# Altium schematic sheet POWER_Management.SchDoc: Metlino
size 420 x 297 mm; CheckedBy: P.Kulik,T.Przywozki,W.Ruclo; Author: G.Kasprowicz; CompanyName: WUT ISE; DrawnBy: G.Kasprowicz; Organization: WUT ISE; Address1: PW ISE; Address2: Nowowiejska 15/19 00-665 Warsaw; Address3: gkasprow@gmail.com; DocumentNumber: 20; Revision: 2; SheetNumber: 20; SheetTotal: 29; ModifiedBy: -; CheckedDate: -; Title2: Power Management Top; DivGrp: WUT ISE; Designer: G.Kasprowicz; ModifiedDate: -; ProjectName: Sensor Box
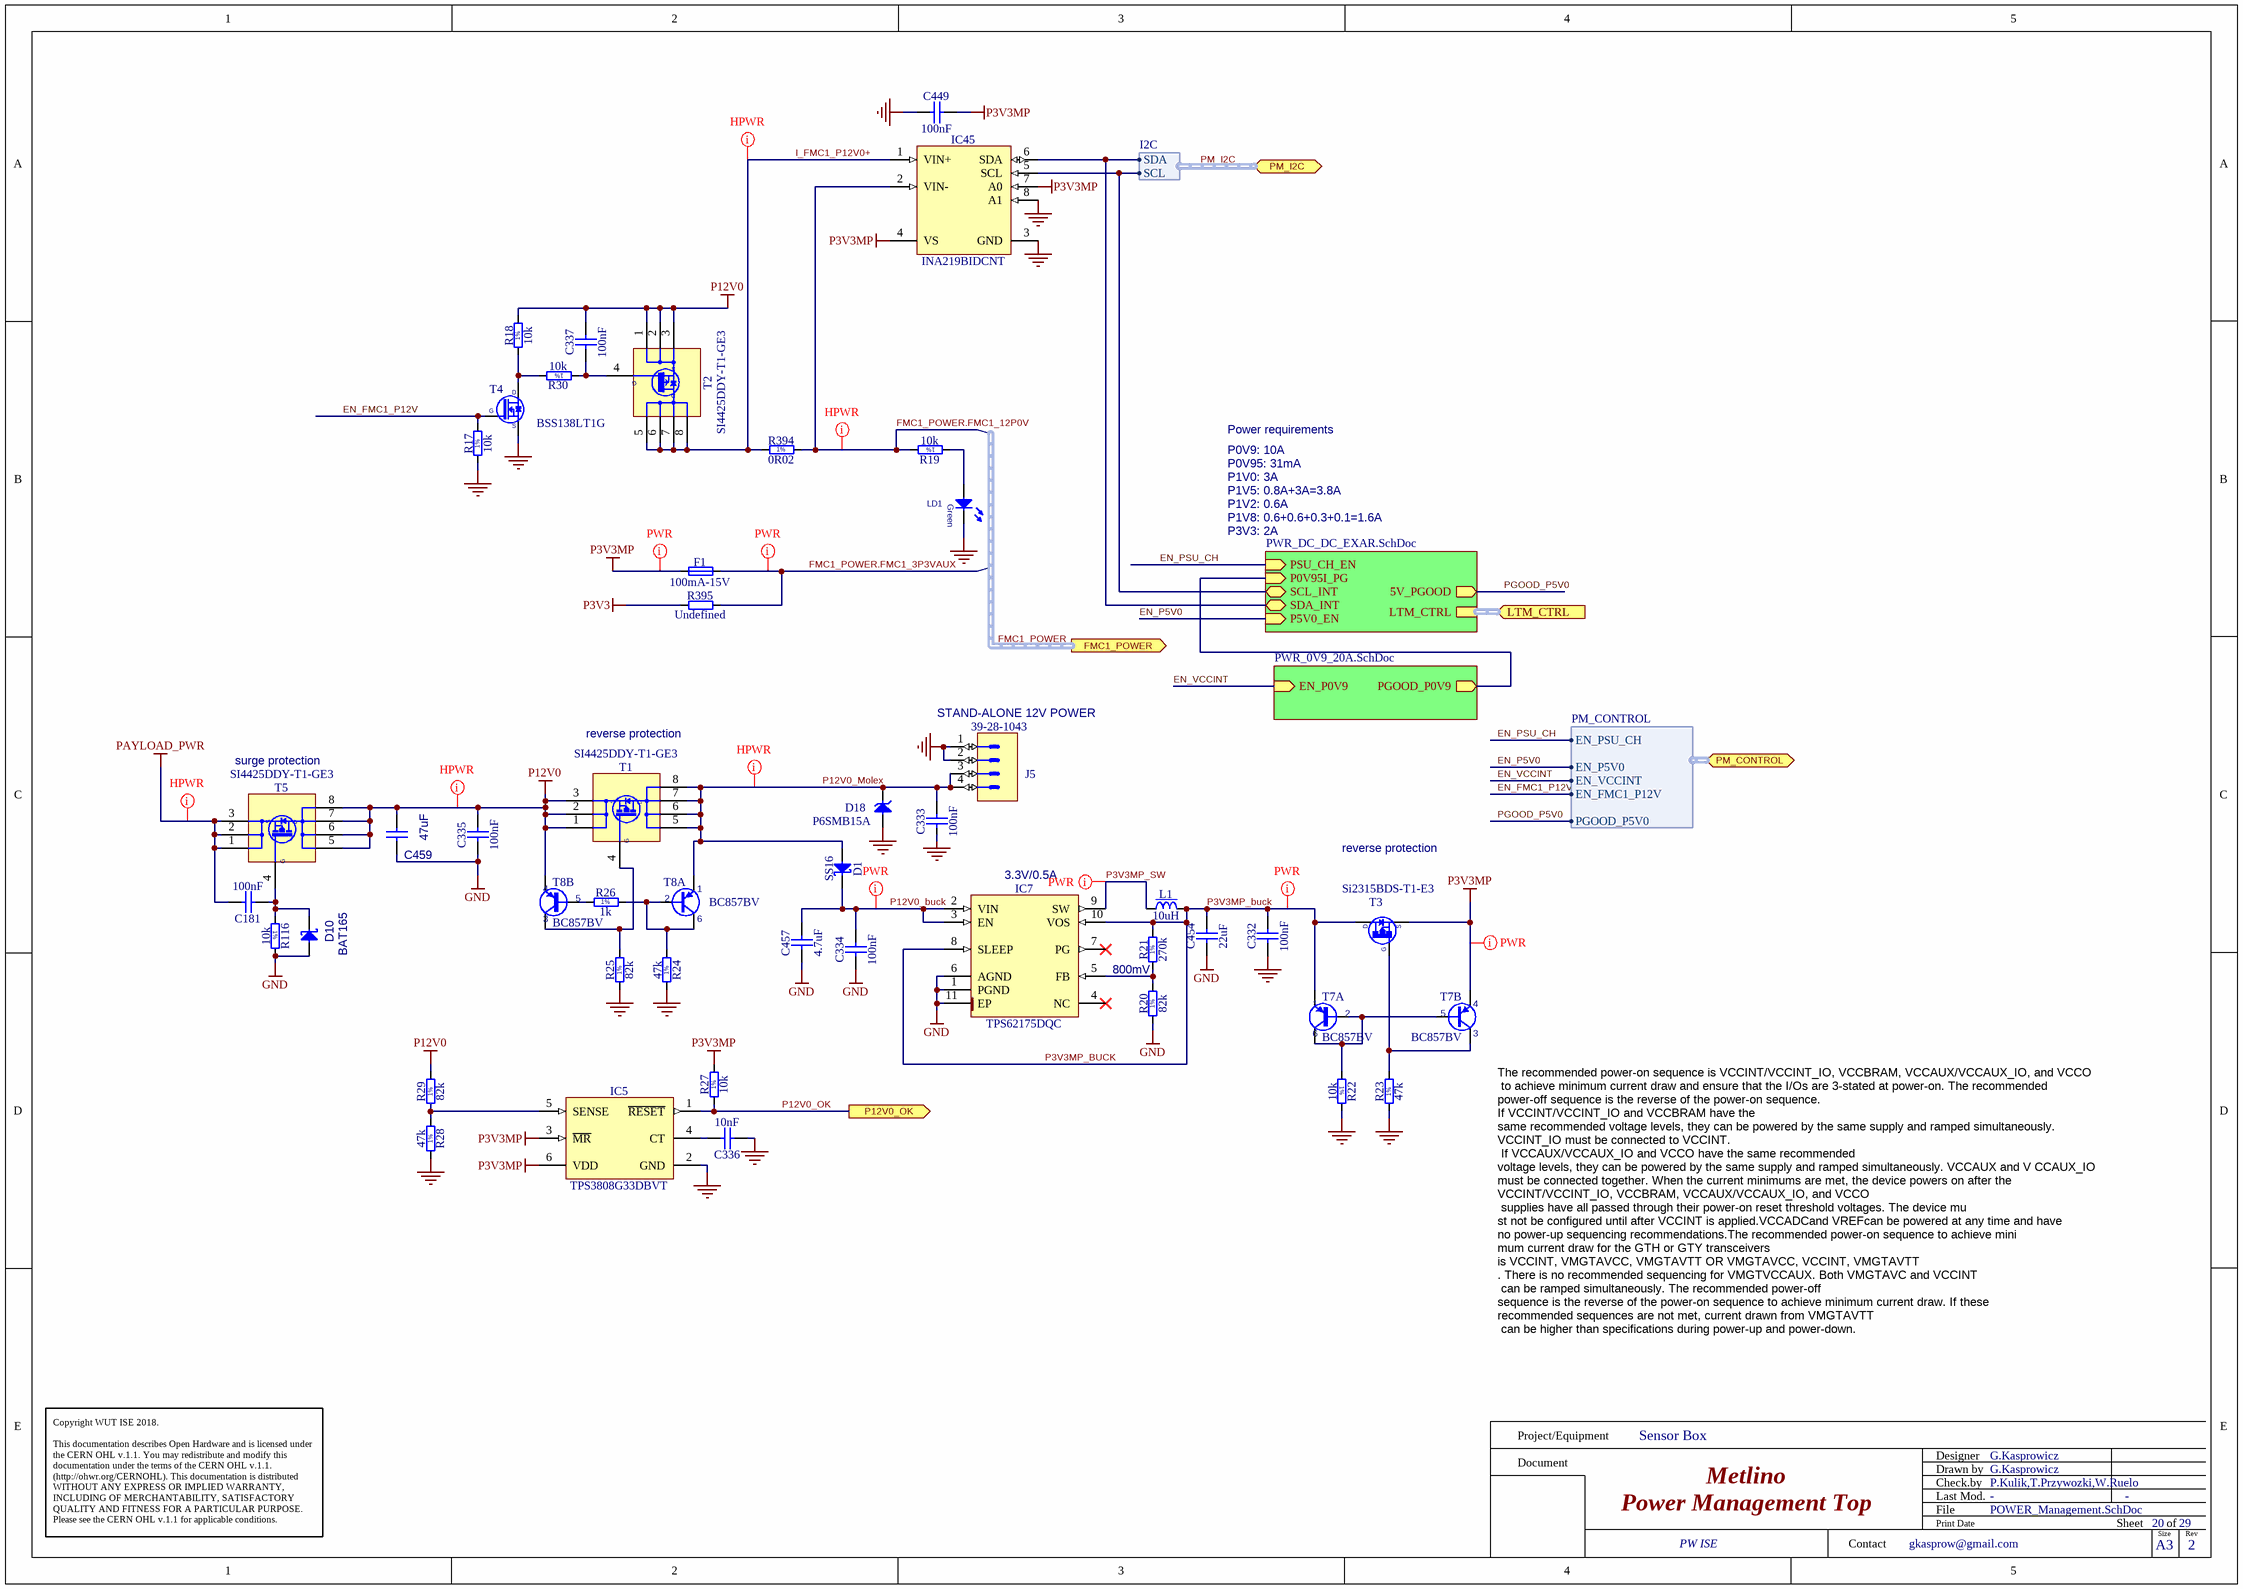
[diagram p0: POWER_Management.SchDoc]

## Parts
C181  100nF  [CAPC1005X55N]
C332  100nF  [CAPC1005X55N]
C333  100nF  [CAPC1005X55N]
C334  100nF  [CAPC1005X55N]
C335  100nF  [CAPC1005X55N]
C336  10nF  [CAPC1005X55N]
C337  100nF  [CAPC1005X55N]
C449  100nF  [CAPC1005X55N]
C454  22uF  [CAPC2012X135N]
C457  4.7uF  [CAPC1709X95N]
C459  47uF  [CAPC3216X180N]
D1  SS16  [DIOM5127X229N]
D10  BAT165  [SOD2512X110N]
D18  P6SMB15A  [DIOM5436X261N]
F1  100mA-15V  [FUSR_LITTELFUSE_0805L010]
IC5  TPS3808G33DBVT  [SOT95P280X145-6N]
IC7  TPS62175DQC  [SON50P200X300X80-11N-R94X250]
IC45  INA219BIDCNT  [SOT65P280X145-8N]
J5  Manufacturer Part Number: 39-28-1043  [MOLEX_39-28-1043]  (hidden comment: Mini-Fit Jr.™)
L1  10uH  [IND_MURATA-PS_8400]
LD1  LED_OSRAM_LG L29K-G2J1-24-Z  [LED_OSRAM_LGL29K]  (value not drawn)
R17  10k  [RESC1005X40N]
R18  10k  [RESC1005X40N]
R19  10k  [RESC1005X40N]
R20  82k  [RESC1005X40N]
R21  270k  [RESC1005X40N]
R22  10k  [RESC1005X40N]
R23  47k  [RESC1005X40N]
R24  47k  [RESC1005X40N]
R25  82k  [RESC1005X40N]
R26  1k  [RESC1005X40N]
R27  10k  [RESC1005X40N]
R28  47k  [RESC1005X40N]
R29  82k  [RESC1005X40N]
R30  10k  [RESC1005X40N]
R116  10k  [RESC1005X40N]
R394  0R02  [RESC_VISHAY_WSL2512_0R007-0R5]
R395  Undefined  [RESC2012X60N]
T1  SI4425DDY-T1-GE3  [SOIC127P600X175-8N]
T2  SI4425DDY-T1-GE3  [SOIC127P600X175-8N]
T3  Si2315BDS-T1-E3  [SOT95P237X112-3N]
T4  BSS138LT1G  [SOT95P240X110-3N]
T5  SI4425DDY-T1-GE3  [SOIC127P600X175-8N]
T7  BC857BV  [SOTFL50P160X60-6N]  (parts A,B of 2)
T8  BC857BV  [SOTFL50P160X60-6N]  (parts A,B of 2)

## Sub-sheets
PWR_0V9_20A = PWR_0V9_20A.SchDoc: PGOOD_P0V9 (out), EN_P0V9 (in)  | CmpIndex: 17; SymIndex: 784
PWR_DC_DC_EXAR = PWR_DC_DC_EXAR.SchDoc: PSU_CH_EN (in), P5V0_EN (in), 5V_PGOOD (out), SDA_INT (bidir), SCL_INT (bidir), LTM_CTRL (harness LTM_CTRL), P0V95I_PG (in)  | CmpIndex: 9; SymIndex: 296

## Ports
FMC1_POWER (out, harness FMC1_POWER), LTM_CTRL (in, harness LTM_CTRL), P12V0_OK (out), PM_CONTROL (bidir, harness PM_CONTROL), PM_I2C (bidir, harness I2C)

## Harnesses
I2C: SCL, SDA
PM_CONTROL: PGOOD_P5V0, EN_FMC1_P12V, EN_VCCINT, EN_P5V0, EN_PSU_CH

## Nets
GND: C332.1 C333.1 C334.1 C335.1 C336.1 C449.1 C454.1 C457.1 C459.1 D10.2(A) D18.2(A) IC5.2(GND) IC7.1(PGND) IC7.6(AGND) IC7.11(EP) IC45.3(GND) IC45.8(A1) J5.1 J5.2 LD1.1(C) R17.1 R20.1 R22.2 R23.1 R24.1 R25.1 R28.1 R116.2 T4.2(S)
P3V3: R395.1
P3V3MP: C449.2 F1.1 IC5.3(~{MR}) IC5.6(VDD) IC45.4(VS) IC45.7(A0) R27.2 T3.2(S) T7.4(E)
P12V0: C335.2 C337.2 C459.2 R18.2 R29.2 T1.1(S) T1.2(S) T1.3(S) T2.1(S) T2.2(S) T2.3(S) T5.5(D) T5.6(D) T5.7(D) T5.8(D) T8.4(E)
PAYLOAD_PWR: C181.2 T5.1(S) T5.2(S) T5.3(S)
EN_FMC1_P12V: R17.2 T4.1(G) ; port PM_CONTROL.EN_FMC1_P12V
EN_P5V0: sheet PWR_DC_DC_EXAR/P5V0_EN, port PM_CONTROL.EN_P5V0
EN_PSU_CH: sheet PWR_DC_DC_EXAR/PSU_CH_EN, port PM_CONTROL.EN_PSU_CH
EN_VCCINT: sheet PWR_0V9_20A/EN_P0V9, port PM_CONTROL.EN_VCCINT
FMC1_POWER.FMC1_3P3VAUX: F1.2 R395.2
FMC1_POWER.FMC1_12P0V: IC45.2(VIN-) R19.2 R394.2
I_FMC1_P12V0+: IC45.1(VIN+) R394.1 T2.5(D) T2.6(D) T2.7(D) T2.8(D)
P3V3MP_BUCK: C332.2 C454.2 IC7.8(SLEEP) IC7.10(VOS) L1.2 R21.2 T3.3(D) T7.1(E)
P3V3MP_SW: IC7.9(SW) L1.1
P12V0_buck: C334.2 C457.2 D1.1(C) IC7.2(VIN) IC7.3(EN)
P12V0_Molex: C333.2 D1.2(A) D18.1(C) J5.3 J5.4 T1.5(D) T1.6(D) T1.7(D) T1.8(D) T8.1(E)
P12V0_OK: IC5.1(~{RESET}) R27.1 ; port P12V0_OK
PGOOD_P5V0: sheet PWR_DC_DC_EXAR/5V_PGOOD, port PM_CONTROL.PGOOD_P5V0
PM_I2C.SCL: IC45.5(SCL) ; sheet PWR_DC_DC_EXAR/SCL_INT, port PM_I2C.SCL
PM_I2C.SDA: IC45.6(SDA) ; sheet PWR_DC_DC_EXAR/SDA_INT, port PM_I2C.SDA
NetC181_1: C181.1 D10.1(C) R116.1 T5.4(S)
NetC336_2: C336.2 IC5.4(CT)
NetC337_1: C337.1 R30.1 T2.4(S)
NetIC5_5: IC5.5(SENSE) R28.2 R29.1
NetIC7_5: IC7.5(FB) R20.2 R21.1
NetLD1_2: LD1.2(A) R19.1
NetR18_1: R18.1 R30.2 T4.3(D)
NetR22_1: R22.1 T7.2(B) T7.5(B) T7.6(C)
NetR23_2: R23.2 T3.1(G) T7.3(C)
NetR24_2: R24.2 R26.2 T8.2(B) T8.6(C)
NetR25_2: R25.2 T1.4(S) T8.3(C)
NetR26_1: R26.1 T8.5(B)
(unnamed): sheet PWR_0V9_20A/PGOOD_P0V9, sheet PWR_DC_DC_EXAR/P0V95I_PG

Not connected (* = marked no-connect by the designer): IC7 4(NC)* 7(PG)*

## Buses and harness runs
harness FMC1_POWER = port FMC1_POWER
harness PM_I2C = port PM_I2C
harness port LTM_CTRL = sheet PWR_DC_DC_EXAR/LTM_CTRL

## Layout directives
net class PWR: FMC1_POWER.FMC1_3P3VAUX, P3V3MP, P3V3MP_BUCK, P3V3MP_SW, P12V0_buck
net class HPWR: FMC1_POWER.FMC1_12P0V, I_FMC1_P12V0+, P12V0, P12V0_Molex, PAYLOAD_PWR

## Notes on the sheet
- P0V9: 10A
- Power requirements
- P0V95: 31mA
- P1V0: 3A
- P1V8: 0.6+0.6+0.3+0.1=1.6A
- P1V2: 0.6A
- P1V5: 0.8A+3A=3.8A
- P3V3: 2A
- (near T1) reverse protection
- (near J5) STAND-ALONE 12V POWER
- (near T5) surge protection
- reverse protection
- (near IC7) 3.3V/0.5A
- 800mV
- (near T7) The recommended power-on sequence is VCCINT/VCCINT_IO, VCCBRAM, VCCAUX/VCCAUX_IO, and VCCO
  to achieve minimum current draw and ensure that the I/Os are 3-stated at power-on. The recommended
  power-off sequence is the reverse of the power-on sequence.
  If VCCINT/VCCINT_IO and VCCBRAM have the
  same recommended voltage levels, they can be powered by the same supply and ramped simultaneously.
  VCCINT_IO must be connected to VCCINT.
  If VCCAUX/VCCAUX_IO and VCCO have the same recommended
  voltage levels, they can be powered by the same supply and ramped simultaneously. VCCAUX and V CCAUX_IO
  must be connected together. When the current minimums are met, the device powers on after the
  VCCINT/VCCINT_IO, VCCBRAM, VCCAUX/VCCAUX_IO, and VCCO
  supplies have all passed through their power-on reset threshold voltages. The device mu
  st not be configured until after VCCINT is applied.VCCADCand VREFcan be powered at any time and have
  no power-up sequencing recommendations.The recommended power-on sequence to achieve mini
  mum current draw for the GTH or GTY transceivers
  is VCCINT, VMGTAVCC, VMGTAVTT OR VMGTAVCC, VCCINT, VMGTAVTT
  . There is no recommended sequencing for VMGTVCCAUX. Both VMGTAVC and VCCINT
  can be ramped simultaneously. The recommended power-off
  sequence is the reverse of the power-on sequence to achieve minimum current draw. If these
  recommended sequences are not met, current drawn from VMGTAVTT
  can be higher than specifications during power-up and power-down.
- Project/Equipment
- Document
- Designer
- Drawn by
- Check.by
- Copyright WUT ISE 2018.
  This documentation describes Open Hardware and is licensed under the CERN OHL v.1.1. You may redistribute and modify this documentation under the terms of the CERN OHL v.1.1. (http://ohwr.org/CERNOHL). This documentation is distributed WITHOUT ANY EXPRESS OR IMPLIED WARRANTY, INCLUDING OF MERCHANTABILITY, SATISFACTORY QUALITY AND FITNESS FOR A PARTICULAR PURPOSE. Please see the CERN OHL v.1.1 for applicable conditions.
- Contact
- File
- Last Mod.
- Print Date
- Sheet
- Size
- A3
- of
- Rev
- (in symbol R0402_1K_1%_0.0625W_100PPM) 1%
- (in symbol R0402_10K_1%_0.0625W_100PPM) 1%
- (in symbol R0402_47K_1%_0.0625W_100PPM) 1%
- (in symbol R0402_82K_1%_0.0625W_100PPM) 1%
- (in symbol R0402_270K_1%_0.0625W_100PPM) 1%
- (in symbol R2512_0R02_1%_1W_75PPM_VISHAY_WSL) 1%
- (in symbol SI4425DDY-T1-GE3) G

## Library data of the parts
C181 C332-C335 C337 C449 = CC0402_100NF_16V_10%_X5R: Non-polarised capacitor; Manufacturer: GENERIC; Part Description: SMD Multilayer Chip Ceramic Capacitor; Manufacturer1 Part Number: GRM155R61C104KA88D; Tolerance: ±10%; Voltage: 16V; TC: X5R; Manufacturer Part Number: CC0402_100NF_16V_10%_X5R; Part Number: CC0402_100NF_16V_10%_X5R; Value: 100nF; Component Kind: Standard; Component Type: Standard; Pin Count: 2; Status: None; Case: 0402; Mounted: Yes; Socket: No; SMD: Yes; Sense: No; Manufacturer1 Example: MURATA; Manufacturer1 ComponentHeight: 0.55mm; HelpURL: \\cern.ch\dfs\Applications\Altium\Datasheets\CC0402_X5R_MURATA_GRM.pdf; Author: CERN DEM JLC; CreateDate: 10.12.2013; LatestRevisionDate: 10.12.2013
C336 = CC0402_10NF_16V_10%_X7R: Non-polarised capacitor; Manufacturer: GENERIC; Part Description: SMD Multilayer Chip Ceramic Capacitor; Manufacturer1 Part Number: 223878715636; Tolerance: ±10%; Voltage: 16V; TC: X7R; Manufacturer Part Number: CC0402_10NF_16V_10%_X7R; Part Number: CC0402_10NF_16V_10%_X7R; Value: 10nF; Component Kind: Standard; Component Type: Standard; Pin Count: 2; Status: Not Recommended; Case: 0402; Mounted: Yes; Socket: No; SMD: Yes; Sense: No; Manufacturer1 Example: PHYCOMP; Manufacturer1 ComponentHeight: 0.55mm; HelpURL: \\cern.ch\dfs\Applications\Altium\Datasheets\CC0402_X7R_PHYCOMP.pdf; Author: CERN DEM JLC; CreateDate: 03.12.2007; LatestRevisionDate: 03.12.2007
C454 = CC0805_22UF_16V_10%_X5R: Non-polarised capacitor; Manufacturer: GENERIC; Part Description: SMD Multilayer Chip Ceramic Capacitor; Manufacturer1 Part Number: C2012X5R1C226KT; Tolerance: ±10%; Voltage: 16V; TC: X5R; Manufacturer Part Number: CC0805_22UF_16V_10%_X5R; Part Number: CC0805_22UF_16V_10%_X5R; Value: 22uF; Component Kind: Standard; Component Type: Standard; Pin Count: 2; Status: Preferred; Case: 0805; Mounted: Yes; Socket: No; SMD: Yes; Sense: No; Manufacturer1 Example: TDK; Manufacturer1 ComponentHeight: 1.35mm; HelpURL: \\cern.ch\dfs\Applications\Altium\Datasheets\CC0805_X5R_TDK_C.pdf; Author: CERN DEM JLC; CreateDate: 25.10.2012; LatestRevisionDate: 25.10.2012
C457 = CC0603_4.7UF_16V_10%_X5R: Non-polarised capacitor; Manufacturer: GENERIC; Part Description: SMD Multilayer Chip Ceramic Capacitor; Manufacturer1 Part Number: EMK107ABJ475KA-T; Tolerance: ±10%; Voltage: 16V; TC: X5R; Manufacturer Part Number: CC0603_4.7UF_16V_10%_X5R; Part Number: CC0603_4.7UF_16V_10%_X5R; Value: 4.7uF; Component Kind: Standard; Component Type: Standard; Pin Count: 2; Status: None; Case: 0603; Mounted: Yes; Socket: No; SMD: Yes; Sense: No; Manufacturer1 Example: TAIYO YUDEN; Manufacturer1 ComponentHeight: 0.95mm; HelpURL: \\cern.ch\dfs\Applications\Altium\Datasheets\CC0603_X7R_TAIYO-YUDEN_HIGH-VALUE.pdf; Author: CERN DEM JLC; CreateDate: 16.12.2013; LatestRevisionDate: 16.09.2014
C459 = CAPC3216X180N: $$NotCommonProperty_General Part Number: CC1206_47UF_25V_20%_X5R; Manufacturer Part Number: C3216X5R1E476M160AC; Manufacturer: TDK; Part Description: SMD Multilayer Chip Ceramic Capacitor; Part Name: Capacitor - non polarized CAPC3216X180N; $$Internal_Resolution: 00001mm; $$NotCommonProperty_Case: 1206; $$NotCommonProperty_Pin Count: 2; $$NotCommonProperty_SMD: Yes; $$NotCommonProperty_Status: None; $$NotCommonProperty_TC: X5R; $$NotCommonProperty_Voltage: 25V; CmpIndex: 100; DXDB_LIBNAME: Capacitors SMD; Ref Designator: C459; SymIndex: 331; Tolerance: ±20%; $$NotCommonProperty_ComponentHeight: 1.8mm; Cell Name: CAPC3216X180N; Part Number: Capacitor - non polarized CAPC3216X180N; Value: 47uF; Orientation: 1 = 1
D1 = SS16: Schottky Diode; Manufacturer: VISHAY GENERAL SEMICONDUCTOR; Part Description: Surface Mount Schottky Barrier Rectifier; Voltage: 60V; Power: 1A; PressFit: No; Bonding: No; Manufacturer Part Number: SS16; PackageDescription: DO-214-AC Molded Diode, Body 5.1x2.7mm, IPC Medium Density; Part Number: SS16; Component Kind: Standard; Component Type: Standard; Device: SS16; Pin Count: 2; Case: DO-214AC; Mounted: Yes; Socket: No; SMD: Yes; Sense: No; ComponentHeight: 2.29mm; HelpURL: \\cern.ch\dfs\Applications\Altium\Datasheets\SS16.pdf; Author: CERN DEM JLC; CreateDate: 15.07.2008; LatestRevisionDate: 23.08.2010
D10 = SOD2512X110N: Manufacturer: INFINEON; Part Description: Medium Power AF Schottky Diode; $$Internal_Resolution: 00001mm; $$NotCommonProperty_Bonding: No; $$NotCommonProperty_Case: SOD323; $$NotCommonProperty_Library Ref: Diode Schottky; $$NotCommonProperty_Mounted: Yes; $$NotCommonProperty_Pin Count: 2; $$NotCommonProperty_Power: 750mA; $$NotCommonProperty_PressFit: No; $$NotCommonProperty_Voltage: 40V; CmpIndex: 25; DXDB_LIBNAME: Diodes; SymIndex: 381; $$NotCommonProperty_ComponentHeight: 1.1mm; $$NotCommonProperty_Device: BAT165; $$NotCommonProperty_Footprint Ref: SOD2512X110N; $$NotCommonProperty_Sense: No; $$NotCommonProperty_SMD: Yes; $$NotCommonProperty_Socket: No; Cell Name: SOD2512X110N; Manufacturer Part Number: BAT165; PackageDescription: Small Outline Diode Flat Lead (SOD-323), 1.70mm W X 1.25mm L X 1.10mm H body,  IPC Medium Density; Part Name: BAT165; Part Number: BAT165; Orientation: 1 = 1
D18 = P6SMB15A: Transient Voltage Suppressor Diode (Uni-Directional); Manufacturer: LITTELFUSE; Part Description: Uni-directional Transient Voltage Suppressor (TVS) Diode; Voltage: 15V; Power: 600W; PressFit: No; Bonding: No; Manufacturer Part Number: P6SMB15A; PackageDescription: DO-214-AA/SMB Diode, Molded Body; 5.40mm L X 3.62mm W X 2.61mm H, IPC Medium Density; Part Number: P6SMB15A; Component Kind: Standard; Component Type: Standard; Device: P6SMB15A; Pin Count: 2; Case: SMB; Mounted: Yes; Socket: No; SMD: Yes; Sense: No; ComponentHeight: 2.61mm; HelpURL: \\cern.ch\dfs\Applications\Altium\Datasheets\P6SMB15A.pdf; Author: CERN DEM JLC; CreateDate: 12.07.2017; LatestRevisionDate: 12.07.2017
F1 = FUSR_LITTELFUSE_0805L010YR: Fuse; Part Description: POLYFUSE® Surface Mount Resettable PTC; PressFit: No; Manufacturer Part Number: 0805L010YR; Manufacturer: LITTELFUSE; PackageDescription: Surface Mount POLY-FUSE® Resettable PTC, 0805L Series; Part Number: FUSR_LITTELFUSE_0805L010YR; Value: 100mA-15V; Component Kind: Standard; Component Type: Standard; Pin Count: 2; Family: Fuses Resettable; Mounted: Yes; Socket: No; SMD: Yes; Sense: No; ComponentHeight: 1mm; HelpURL: \\cern.ch\dfs\Applications\Altium\Datasheets\FUSR_LITTELFUSE_0805L010YR.pdf; Author: CERN DEM JLC; CreateDate: 11.09.2012; LatestRevisionDate: 11.09.2012
IC5 = TPS3808G33DBVT: Low Quiescent Current, Programmable-Delay Supervisory Circuit; Manufacturer: TEXAS INSTRUMENTS; Part Description: 3.3V, Low Quiescent Current, Programmable-Delay Supervisory Circuit; PressFit: No; Bonding: No; Manufacturer Part Number: TPS3808G33DBVT; PackageDescription: SOT23, 6-Leads, Body 1.6x3.0mm, Pitch 0.95mm, IPC Medium Density; Part Number: TPS3808G33DBVT; Component Kind: Standard; Component Type: Standard; Device: TPS3808G33DBVT; Pin Count: 6; Case: SOT23-6; Mounted: Yes; Socket: No; SMD: Yes; Sense: No; ComponentHeight: 1.45mm; Author: CERN DEM JLC; HelpURL: \\cern.ch\dfs\Applications\Altium\Datasheets\TPS3808G33DBVT.pdf; CreateDate: 05.11.2013; LatestRevisionDate: 05.11.2013
IC7 = TPS62175DQC: 4.75-28VDC to 1-6VDC, 500mA Step-Down Converter With Sleep Mode; Manufacturer: TEXAS INSTRUMENTS; PressFit: No; Bonding: No; Manufacturer Part Number: TPS62175DQC; PackageDescription: SON, 10-Leads, Body 2x3mm, Pitch 0.5mm, Thermal Pad 0.94x2.5mm, IPC Medium Density; Part Description: 4.75-28VDC to 1-6VDC, 500mA Step-Down Converter With Sleep Mode; Part Number: TPS62175DQC; Component Kind: Standard; Component Type: Standard; Device: TPS62175DQC; Pin Count: 11; Case: SON10; Mounted: Yes; Socket: No; SMD: Yes; Sense: No; ComponentHeight: 0.8mm; HelpURL: \\cern.ch\dfs\Applications\Altium\Datasheets\TPS62175DQC.pdf; Author: CERN DEM JMW; CreateDate: 11.08.2015; LatestRevisionDate: 11.08.2015
IC45 = INA219BIDCNT: Zero-Drift, Bi-Directional CURRENT/POWER MONITOR with I2C™ Interface; Manufacturer: TEXAS INSTRUMENTS; PressFit: No; Bonding: No; Manufacturer Part Number: INA219BIDCNT; PackageDescription: SOT, 0.65mm pitch; 8 pin, 1.625mm W X 2.90mm L X 1.45mm H body, IPC Medium Density; Part Description: Zero-Drift, Bi-Directional CURRENT/POWER MONITOR with I2C™ Interface; Part Number: INA219BIDCNT; Component Kind: Standard; Component Type: Standard; Device: INA219BIDCNT; Pin Count: 8; Case: SOT23-8; Mounted: Yes; Socket: No; SMD: Yes; Sense: No; ComponentHeight: 1.45mm; Author: CERN DEM JLC; HelpURL: \\cern.ch\dfs\Applications\Altium\Datasheets\INA219BIDCNT.pdf; CreateDate: 24.09.2013; LatestRevisionDate: 24.09.2013
J5 = MOLEX_39-28-1043: Connector 4 Male; Manufacturer: MOLEX; Part Description: 4.20mm (.165") Pitch Mini-Fit Jr.™ Header, Dual Row, Vertical, without Snap-in Plastic Peg PCB Lock, 4 Circuits; PressFit: No; Part Number: MOLEX_39-28-1043; Component Kind: Standard; Component Type: Standard; Pin Count: 4; Family: Mini-Fit Jr.™; Mounted: Yes; Socket: No; SMD: No; Sense: No; Status: None; ComponentHeight: 13.1mm; HelpURL: \\cern.ch\dfs\Applications\Altium\Datasheets\MOLEX_39-28-1043.pdf; Author: CERN DEM JLC; CreateDate: 12.03.2009; LatestRevisionDate: 06.03.2012
L1 = IND_10UH_10%_MURATA-PS_8400: Inductor With Core; Manufacturer Part Number: 84103C; Manufacturer: MURATA POWER SOLUTIONS; Part Description: Miniature Surface Mount Power Inductor (8400 Series); Tolerance: ±10%; Power: 950mA; Resistance: 0.24R; Part Number: IND_10UH_10%_MURATA-PS_8400; Value: 10uH; Component Kind: Standard; Component Type: Standard; Pin Count: 2; Status: None; Mounted: Yes; Socket: No; SMD: Yes; Sense: No; ComponentHeight: 2.9mm; HelpURL: \\cern.ch\dfs\Applications\Altium\Datasheets\IND_MURATA-PS_8400.pdf; Author: CERN DEM JLC; CreateDate: 02.07.2012; LatestRevisionDate: 02.07.2012
LD1 = LED_OSRAM_LGL29K: Manufacturer: OSRAM; Part Description: Surface Mount Green LED (0603 Case); $$Internal_Resolution: 00001mm; $$NotCommonProperty_Author: CERN DEM JLC; $$NotCommonProperty_Bonding: No; $$NotCommonProperty_Case: 0603; $$NotCommonProperty_Color: Green; $$NotCommonProperty_Component Kind: Standard; $$NotCommonProperty_HelpURL: \\cern.ch\dfs\Applications\Altium\Datasheets\LED_OSRAM_LGL29K.pdf; $$NotCommonProperty_Mounted: Yes; $$NotCommonProperty_Pin Count: 2; $$NotCommonProperty_PressFit: No; $$NotCommonProperty_Table: LEDs & Displays; CmpIndex: 61; DXDB_LIBNAME: LED_Displays; Ref Designator: LD1; SymIndex: 383; $$NotCommonProperty_Component Type: Standard; $$NotCommonProperty_ComponentHeight: 0.67mm; $$NotCommonProperty_CreateDate: 2012-04-24; $$NotCommonProperty_Footprint Ref: LED_OSRAM_LGL29K; $$NotCommonProperty_LatestRevisionDate: 2012-04-24; $$NotCommonProperty_Sense: No; $$NotCommonProperty_SMD: Yes; $$NotCommonProperty_Socket: No; Cell Name: LED_OSRAM_LGL29K; Manufacturer Part Number: LG L29K-G2J1-24-Z; PackageDescription: Green Chip LED, 2-Leads, Body 1.7x0.8mm, IPC Medium Density; Part Name: LED_OSRAM_LG L29K-G2J1-24-Z; Part Number: LED_OSRAM_LG L29K-G2J1-24-Z; Orientation: 3 = 3
R17-R19 R22 R27 R30 R116 = R0402_10K_1%_0.0625W_100PPM: Resistor - 1%; Manufacturer: GENERIC; Part Description: General Purpose Thick Film Chip Resistor; Manufacturer1 Part Number: 232270671003L; TC: ±100ppm/°C; PressFit: No; Manufacturer Part Number: R0402_10K_1%_0.0625W_100PPM; Part Number: R0402_10K_1%_0.0625W_100PPM; Tolerance: ±1%; Value: 10k; Component Kind: Standard; Component Type: Standard; Pin Count: 2; Status: Not Recommended; Power: 0.0625W; Case: 0402; Mounted: Yes; Sense: No; Socket: No; SMD: Yes; Manufacturer1 Example: YAGEO PHYCOMP; Manufacturer1 ComponentHeight: 0.4mm; HelpURL: \\cern.ch\dfs\Applications\Altium\Datasheets\R0402_Phycomp_RC0402.pdf; Author: CERN DEM JLC; CreateDate: 03.12.2007; LatestRevisionDate: 17.10.2012
R20 R25 R29 = R0402_82K_1%_0.0625W_100PPM: Resistor - 1%; Manufacturer: GENERIC; Part Description: General Purpose Thick Film Chip Resistor; Manufacturer1 Part Number: 232270678203L; TC: ±100ppm/°C; PressFit: No; Manufacturer Part Number: R0402_82K_1%_0.0625W_100PPM; Part Number: R0402_82K_1%_0.0625W_100PPM; Tolerance: ±1%; Value: 82k; Component Kind: Standard; Component Type: Standard; Pin Count: 2; Status: Not Recommended; Power: 0.0625W; Case: 0402; Mounted: Yes; Sense: No; Socket: No; SMD: Yes; Manufacturer1 Example: YAGEO PHYCOMP; Manufacturer1 ComponentHeight: 0.4mm; HelpURL: \\cern.ch\dfs\Applications\Altium\Datasheets\R0402_Phycomp_RC0402.pdf; Author: CERN DEM JLC; CreateDate: 03.12.2007; LatestRevisionDate: 17.10.2012
R21 = R0402_270K_1%_0.0625W_100PPM: Resistor - 1%; Manufacturer: GENERIC; Part Description: General Purpose Thick Film Chip Resistor; Manufacturer1 Part Number: 232270672704L; TC: ±100ppm/°C; PressFit: No; Manufacturer Part Number: R0402_270K_1%_0.0625W_100PPM; Part Number: R0402_270K_1%_0.0625W_100PPM; Tolerance: ±1%; Value: 270k; Component Kind: Standard; Component Type: Standard; Pin Count: 2; Status: Not Recommended; Power: 0.0625W; Case: 0402; Mounted: Yes; Sense: No; Socket: No; SMD: Yes; Manufacturer1 Example: YAGEO PHYCOMP; Manufacturer1 ComponentHeight: 0.4mm; HelpURL: \\cern.ch\dfs\Applications\Altium\Datasheets\R0402_Phycomp_RC0402.pdf; Author: CERN DEM JLC; CreateDate: 03.12.2007; LatestRevisionDate: 17.10.2012
R23 R24 R28 = R0402_47K_1%_0.0625W_100PPM: Resistor - 1%; Manufacturer: GENERIC; Part Description: General Purpose Thick Film Chip Resistor; Manufacturer1 Part Number: 232270675103L; TC: ±100ppm/°C; PressFit: No; Manufacturer Part Number: R0402_47K_1%_0.0625W_100PPM; Part Number: R0402_47K_1%_0.0625W_100PPM; Tolerance: ±1%; Value: 47k; Component Kind: Standard; Component Type: Standard; Pin Count: 2; Status: Not Recommended; Power: 0.0625W; Case: 0402; Mounted: Yes; Sense: No; Socket: No; SMD: Yes; Manufacturer1 Example: YAGEO PHYCOMP; Manufacturer1 ComponentHeight: 0.4mm; HelpURL: \\cern.ch\dfs\Applications\Altium\Datasheets\R0402_Phycomp_RC0402.pdf; Author: CERN DEM JLC; CreateDate: 03.12.2007; LatestRevisionDate: 17.10.2012
R26 = R0402_1K_1%_0.0625W_100PPM: Resistor - 1%; Manufacturer: GENERIC; Part Description: General Purpose Thick Film Chip Resistor; Manufacturer1 Part Number: 232270671002L; TC: ±100ppm/°C; PressFit: No; Manufacturer Part Number: R0402_1K_1%_0.0625W_100PPM; Part Number: R0402_1K_1%_0.0625W_100PPM; Tolerance: ±1%; Value: 1k; Component Kind: Standard; Component Type: Standard; Pin Count: 2; Status: Not Recommended; Power: 0.0625W; Case: 0402; Mounted: Yes; Sense: No; Socket: No; SMD: Yes; Manufacturer1 Example: YAGEO PHYCOMP; Manufacturer1 ComponentHeight: 0.4mm; HelpURL: \\cern.ch\dfs\Applications\Altium\Datasheets\R0402_Phycomp_RC0402.pdf; Author: CERN DEM JLC; CreateDate: 03.12.2007; LatestRevisionDate: 17.10.2012
R394 = R2512_0R02_1%_1W_75PPM_VISHAY_WSL: Resistor - 1%; Manufacturer Part Number: WSL2512R0200FEA; Manufacturer: VISHAY DALE; Part Description: Power Metal Strip® Resistor; Power: 1W; TC: ±75ppm/°C; PressFit: No; Part Number: R2512_0R02_1%_1W_75PPM_VISHAY_WSL; Tolerance: ±1%; Value: 0R02; Component Kind: Standard; Component Type: Standard; Pin Count: 2; Status: None; Case: 2512; Mounted: Yes; Sense: No; Socket: No; SMD: Yes; ComponentHeight: 0.89mm; HelpURL: \\cern.ch\dfs\Applications\Altium\Datasheets\R2512_VISHAY_WSL.pdf; Author: CERN DEM JLC; CreateDate: 17.11.2011; LatestRevisionDate: 23.10.2017
R395 = R0805_NO-VALUE: Resistor; Part Description: Reserved Footprint For a 0805 (2012) Chip Resistor; PressFit: No; Mounted: No; Manufacturer Part Number: R0805_NO-VALUE; Manufacturer: Undefined; Part Number: R0805_NO-VALUE; Value: Undefined; Component Kind: Standard; Component Type: Standard; Pin Count: 2; Status: None; Case: 0805; Sense: No; Socket: No; SMD: Yes; Manufacturer1 Example: Undefined; Manufacturer1 Part Number: Undefined; Manufacturer1 ComponentHeight: Undefined; HelpURL: Undefined; Author: CERN DEM JLC; CreateDate: 03.12.2007; LatestRevisionDate: 13.03.2008
T1 T2 T5 = SI4425DDY-T1-GE3: -30V -19.7A P-Channel MOSFET; Manufacturer: VISHAY SILICONIX; PressFit: No; Bonding: No; Manufacturer Part Number: SI4425DDY-T1-GE3; PackageDescription: SOIC 8, Pitch 1.27mm - Body 4x5mm, IPC Medium Density; Part Description: -30V -19.7A P-Channel MOSFET; Part Number: SI4425DDY-T1-GE3; Component Kind: Standard; Component Type: Standard; Device: SI4425DDY-T1-GE3; Pin Count: 8; Case: SOIC8; Mounted: Yes; Socket: No; SMD: Yes; Sense: No; ComponentHeight: 1.75mm; HelpURL: \\cern.ch\dfs\Applications\Altium\Datasheets\SI4425DDY-T1-GE3.pdf; Author: CERN DEM MR; CreateDate: 05.10.2016; LatestRevisionDate: 05.10.2016
T3 = Si2315BDS-T1-E3: P-CHANNEL MOSFET WITH DIODE; Part Description: -12V -3A P-Channel STripFET® II Power MOSFET; Manufacturer: VISHAY SILICONIX; PressFit: No; Bonding: No; Part Number: Si2315BDS-T1-E3; Component Kind: Standard; Component Type: Standard; Device: Si2315BDS-T1-E3; PackageDescription: SOT, 0.95mm, pitch; 3 pin,1.30mm W X 2.92mm L X 1.12mm H body, IPC Medium Density; Manufacturer Part Number: Si2315BDS-T1-E3; Pin Count: 3; Case: SOT23-3; Mounted: Yes; Socket: No; SMD: Yes; Sense: No; ComponentHeight: 1.12mm; HelpURL: \\cern.ch\dfs\Applications\Altium\Datasheets\Si2315BDS-T1-E3.pdf; Author: CERN DEM JLC; CreateDate: 02.05.2011; LatestRevisionDate: 02.05.2011
T4 = BSS138LT1G: N-CHANNEL MOSFET WITH DIODE; Manufacturer: ON SEMICONDUCTOR; Part Description: 50V 200mA N-Channel Enhancement Mode Field-Effect Transistor; PressFit: No; Bonding: No; Manufacturer Part Number: BSS138LT1G; PackageDescription: SOT23 3-Leads, Pitch 0.95mm - Body 1.4x3mm, IPC Medium Density; Part Number: BSS138LT1G; Component Kind: Standard; Component Type: Standard; Device: BSS138LT1G; Pin Count: 3; Case: SOT23-3; Mounted: Yes; Socket: No; SMD: Yes; Sense: No; ComponentHeight: 1.11mm; HelpURL: \\cern.ch\dfs\Applications\Altium\Datasheets\BSS138LT1G.pdf; Author: CERN DEM JLC; CreateDate: 23.03.2009; LatestRevisionDate: 23.03.2009
T7 T8 = BC857BV: 45V, 100mA PNP General Purpose Double Transistor; Manufacturer: NXP SEMICONDUCTORS; Part Description: -45V -100mA PNP General Purpose Double Transistor; PressFit: No; Bonding: No; Manufacturer Part Number: BC857BV; PackageDescription: SOTFL (SOT666), 0.50mm, Pitch; 6 Pin, 1.20mm W X 1.60mm L X 0.60mm H Body, IPC Medium Density; Part Number: BC857BV; Component Kind: Standard; Component Type: Standard; Device: BC857BV; Pin Count: 6; Case: SOT666; Mounted: Yes; Socket: No; SMD: Yes; Sense: No; ComponentHeight: 0.6mm; HelpURL: \\cern.ch\dfs\Applications\Altium\Datasheets\BC857BV.pdf; Author: CERN DEM JLC; CreateDate: 01.12.2011; LatestRevisionDate: 01.12.2011